# Altium schematic sheet NSHID.SchDoc
size A4
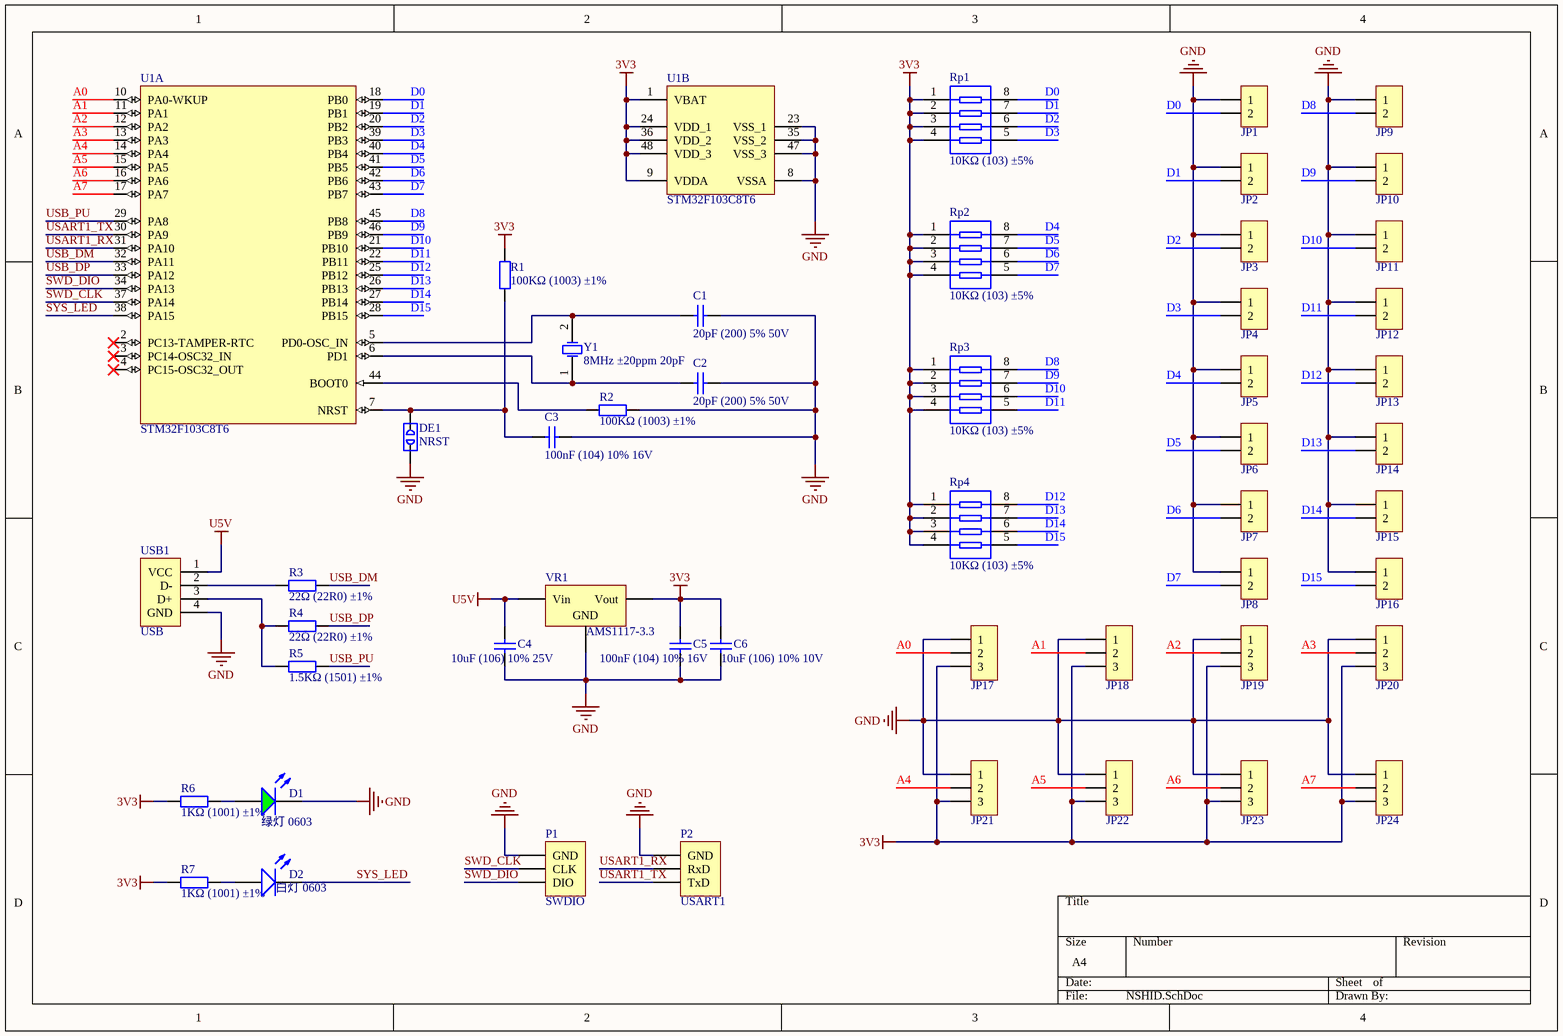
[diagram p0: NSHID.SchDoc]

## Parts
C1  20pF (200) 5% 50V  [0402_C]
C2  20pF (200) 5% 50V  [0402_C]
C3  100nF (104) 10% 16V  [0402_C]
C4  10uF (106) 10% 25V  [0805_C]
C5  100nF (104) 10% 16V  [0402_C]
C6  10uF (106) 10% 10V  [0603_C]
D1  绿灯 0603  [0603_LED_S1]
D2  白灯 0603  [0603_LED_S1]
DE1  NRST  [DEBUG_A]
JP1  HDR-1X2  [XH2.54-LI-2P]  (value not drawn)
JP2  HDR-1X2  [XH2.54-LI-2P]  (value not drawn)
JP3  HDR-1X2  [XH2.54-LI-2P]  (value not drawn)
JP4  HDR-1X2  [XH2.54-LI-2P]  (value not drawn)
JP5  HDR-1X2  [XH2.54-LI-2P]  (value not drawn)
JP6  HDR-1X2  [XH2.54-LI-2P]  (value not drawn)
JP7  HDR-1X2  [XH2.54-LI-2P]  (value not drawn)
JP8  HDR-1X2  [XH2.54-LI-2P]  (value not drawn)
JP9  HDR-1X2  [XH2.54-LI-2P]  (value not drawn)
JP10  HDR-1X2  [XH2.54-LI-2P]  (value not drawn)
JP11  HDR-1X2  [XH2.54-LI-2P]  (value not drawn)
JP12  HDR-1X2  [XH2.54-LI-2P]  (value not drawn)
JP13  HDR-1X2  [XH2.54-LI-2P]  (value not drawn)
JP14  HDR-1X2  [XH2.54-LI-2P]  (value not drawn)
JP15  HDR-1X2  [XH2.54-LI-2P]  (value not drawn)
JP16  HDR-1X2  [XH2.54-LI-2P]  (value not drawn)
JP17  HDR-1X3  [XH2.54-LI-3P]  (value not drawn)
JP18  HDR-1X3  [XH2.54-LI-3P]  (value not drawn)
JP19  HDR-1X3  [XH2.54-LI-3P]  (value not drawn)
JP20  HDR-1X3  [XH2.54-LI-3P]  (value not drawn)
JP21  HDR-1X3  [XH2.54-LI-3P]  (value not drawn)
JP22  HDR-1X3  [XH2.54-LI-3P]  (value not drawn)
JP23  HDR-1X3  [XH2.54-LI-3P]  (value not drawn)
JP24  HDR-1X3  [XH2.54-LI-3P]  (value not drawn)
P1  SWDIO  [HDR1X3]
P2  USART1  [HDR1X3]
R1  100KΩ (1003) ±1%  [0402_R]
R2  100KΩ (1003) ±1%  [0402_R]
R3  22Ω (22R0) ±1%  [0402_R]
R4  22Ω (22R0) ±1%  [0402_R]
R5  1.5KΩ (1501) ±1%  [0402_R]
R6  1KΩ (1001) ±1%  [0402_R]
R7  1KΩ (1001) ±1%  [0402_R]
Rp1  10KΩ (103) ±5%  [0402_Rx4]
Rp2  10KΩ (103) ±5%  [0402_Rx4]
Rp3  10KΩ (103) ±5%  [0402_Rx4]
Rp4  10KΩ (103) ±5%  [0402_Rx4]
U1  STM32F103C8T6  [LQFP-48_7x7x05P]  (parts A,B of 2)
USB1  USB  [USB-B/S_A]
VR1  AMS1117-3.3  [SOT-223]
Y1  8MHz ±20ppm 20pF  [SMD-5032_2P]

## Nets
3V3: C5.2 C6.2 JP17.3 JP18.3 JP19.3 JP20.3 JP21.3 JP22.3 JP23.3 JP24.3 R1.2 R6.1 R7.2 Rp1.1 Rp1.2 Rp1.3 Rp1.4 Rp2.1 Rp2.2 Rp2.3 Rp2.4 Rp3.1 Rp3.2 Rp3.3 Rp3.4 Rp4.1 Rp4.2 Rp4.3 Rp4.4 U1.1(VBAT) U1.9(VDDA) U1.24(VDD_1) U1.36(VDD_2) U1.48(VDD_3) VR1.2(Vout)
GND: C1.2 C2.2 C3.1 C4.1 C5.1 C6.1 D1.K DE1.2 JP1.1 JP2.1 JP3.1 JP4.1 JP5.1 JP6.1 JP7.1 JP8.1 JP9.1 JP10.1 JP11.1 JP12.1 JP13.1 JP14.1 JP15.1 JP16.1 JP17.1 JP18.1 JP19.1 JP20.1 JP21.1 JP22.1 JP23.1 JP24.1 P1.1(GND) P2.1(GND) R2.2 U1.8(VSSA) U1.23(VSS_1) U1.35(VSS_2) U1.47(VSS_3) USB1.4(GND) VR1.1(GND)
U5V: C4.2 USB1.1(VCC) VR1.3(Vin)
A0: JP17.2 U1.10(PA0-WKUP)
A1: JP18.2 U1.11(PA1)
A2: JP19.2 U1.12(PA2)
A3: JP20.2 U1.13(PA3)
A4: JP21.2 U1.14(PA4)
A5: JP22.2 U1.15(PA5)
A6: JP23.2 U1.16(PA6)
A7: JP24.2 U1.17(PA7)
D0: JP1.2 Rp1.8 U1.18(PB0)
D1: JP2.2 Rp1.7 U1.19(PB1)
D2: JP3.2 Rp1.6 U1.20(PB2)
D3: JP4.2 Rp1.5 U1.39(PB3)
D4: JP5.2 Rp2.8 U1.40(PB4)
D5: JP6.2 Rp2.7 U1.41(PB5)
D6: JP7.2 Rp2.6 U1.42(PB6)
D7: JP8.2 Rp2.5 U1.43(PB7)
D8: JP9.2 Rp3.8 U1.45(PB8)
D9: JP10.2 Rp3.7 U1.46(PB9)
D10: JP11.2 Rp3.6 U1.21(PB10)
D11: JP12.2 Rp3.5 U1.22(PB11)
D12: JP13.2 Rp4.8 U1.25(PB12)
D13: JP14.2 Rp4.7 U1.26(PB13)
D14: JP15.2 Rp4.6 U1.27(PB14)
D15: JP16.2 Rp4.5 U1.28(PB15)
SWD_CLK: P1.2(CLK) U1.37(PA14)
SWD_DIO: P1.3(DIO) U1.34(PA13)
SYS_LED: D2.K U1.38(PA15)
USART1_RX: P2.2(RxD) U1.31(PA10)
USART1_TX: P2.3(TxD) U1.30(PA9)
USB_DM: R3.2 U1.32(PA11)
USB_DP: R4.2 U1.33(PA12)
USB_PU: R5.2 U1.29(PA8)
NetC1_1: C1.1 U1.5(PD0-OSC_IN) Y1.2(OSC2)
NetC2_1: C2.1 U1.6(PD1) Y1.1(OSC1)
NetC3_2: C3.2 DE1.1 R1.1 U1.7(NRST)
NetD1_A: D1.A R6.2
NetD2_A: D2.A R7.1
NetR2_1: R2.1 U1.44(BOOT0)
NetR3_1: R3.1 USB1.2(D-)
NetR4_1: R4.1 R5.1 USB1.3(D+)

Not connected (* = marked no-connect by the designer): U1 2(PC13-TAMPER-RTC)* 3(PC14-OSC32_IN)* 4(PC15-OSC32_OUT)*

## Library data of the parts
C1 C2 = 0402 20pF (200) 5% 50V: 贴片电容; ComponentLink1Description: 供应商链接; ComponentLink1URL: http://www.szlcsc.com/product/details_1906.html; Package: 0402; Supplier: LC; SuppliersPartNumber: C1554
C3 C5 = 0402 100nF (104) 10% 16V: 贴片电容; ComponentLink1Description: 供应商链接; ComponentLink1URL: http://www.szlcsc.com/product/details_1877.html; Package: 0402; Supplier: LC; SuppliersPartNumber: C1525
C4 = 0805 10uF (106) 10% 25V: 贴片电容; ComponentLink1Description: 供应商链接; ComponentLink1URL: http://www.szlcsc.com/product/details_16532.html; Package: 0805; Supplier: LC; SuppliersPartNumber: C15850
C6 = 0603 10uF (106) 10% 10V: 贴片电容; ComponentLink1Description: 供应商链接; ComponentLink1URL: http://www.szlcsc.com/product/details_20411.html; Package: 0603; Supplier: LC; SuppliersPartNumber: C19702
D1 = 0603 绿灯: 发光二极管; ComponentLink1Description: 供应商链接; ComponentLink1URL: http://www.szlcsc.com/product/details_73152.html; Package: 0603; Supplier: LC; SuppliersPartNumber: C72043
D2 = 0603 白灯: 发光二极管; ComponentLink1Description: 供应商链接; ComponentLink1URL: http://www.szlcsc.com/product/details_2663.html; Package: 0603; Supplier: LC; SuppliersPartNumber: C2290
DE1 = DEBUG: 调试断点焊盘; 版权归属: 源创客; BOM名称: 调试断点焊盘; 学习资源: www.ooocke.com
JP1-JP16 = Header 2: 2P接插件; 版权归属: 源创客; BOM名称: 2P接插件; 学习资源: www.ooocke.com
JP17-JP24 = Header 3: 3P接插件; 版权归属: 源创客; BOM名称: 3P接插件; 学习资源: www.ooocke.com
P1 P2 = Header 3: Header, 3-Pin; LatestRevisionDate: 17-Jul-2002; LatestRevisionNote: Re-released for DXP Platform.; Publisher: Altium Limited
R1 R2 = 0402 100KΩ (1003) 1%: 贴片电阻; ComponentLink1Description: 供应商链接; ComponentLink1URL: http://www.szlcsc.com/product/details_26484.html; Package: 0402; Supplier: LC; SuppliersPartNumber: C25741
R3 R4 = 0402 22Ω (22R0) 1%: 贴片电阻; ComponentLink1Description: 供应商链接; ComponentLink1URL: http://www.szlcsc.com/product/details_25835.html; Package: 0402; Supplier: LC; SuppliersPartNumber: C25092
R5 = 0402 1.5KΩ (1501) 1%: 贴片电阻; ComponentLink1Description: 供应商链接; ComponentLink1URL: http://www.szlcsc.com/product/details_26610.html; Package: 0402; Supplier: LC; SuppliersPartNumber: C25867
R6 R7 = 0402 1KΩ (1001) 1%: 贴片电阻; ComponentLink1Description: 供应商链接; ComponentLink1URL: http://www.szlcsc.com/product/details_12256.html; Package: 0402; Supplier: LC; SuppliersPartNumber: C11702
Rp1-Rp4 = 0402*4 10KΩ (103) 5%: 贴片排阻; ComponentLink1Description: 供应商链接; ComponentLink1URL: http://www.szlcsc.com/product/details_26468.html; Package: 0402*4; Supplier: LC; SuppliersPartNumber: C25725
U1 = STM32F103C8T6: ARM; ComponentLink1Description: 供应商链接; ComponentLink1URL: http://www.szlcsc.com/product/details_9243.html; Package: LQFP-48_7x7x05P; Supplier: LC; SuppliersPartNumber: C8734
USB1 = USB-B/S: USB-B型母接口; 版权归属: 源创客; BOM名称: USB-B型母接口; 学习资源: www.ooocke.com
VR1 = SOT-223 AMS1117-3.3: 低压差线性稳压(LDO); ComponentLink1Description: 供应商链接; ComponentLink1URL: http://www.szlcsc.com/product/details_6652.html; Package: SOT-223; Supplier: LC; SuppliersPartNumber: C6186
Y1 = SMD-5032_2P 8MHz 20ppm 20pF: 贴片晶振; ComponentLink1Description: 供应商链接; ComponentLink1URL: http://www.szlcsc.com/product/details_117214.html; Package: SMD-5032_2P; Supplier: LC; SuppliersPartNumber: C115962